# EasyEDA Pro project mcuboardpcb.epro

# Board PCB3
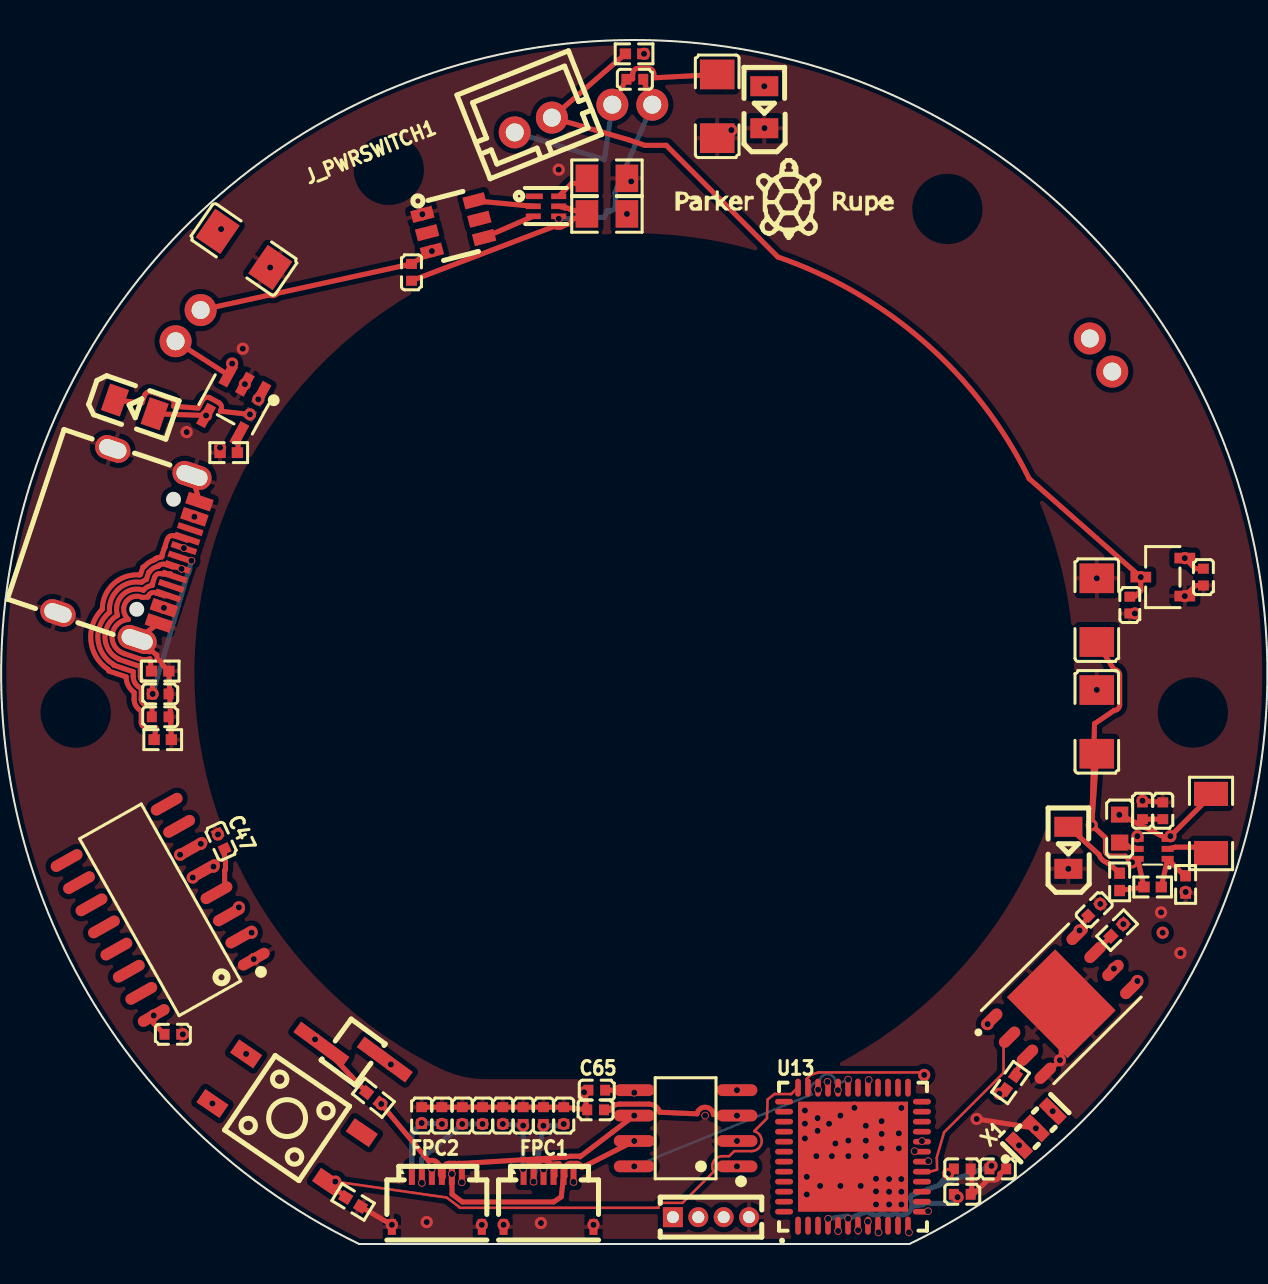
[diagram p0: board, top side]
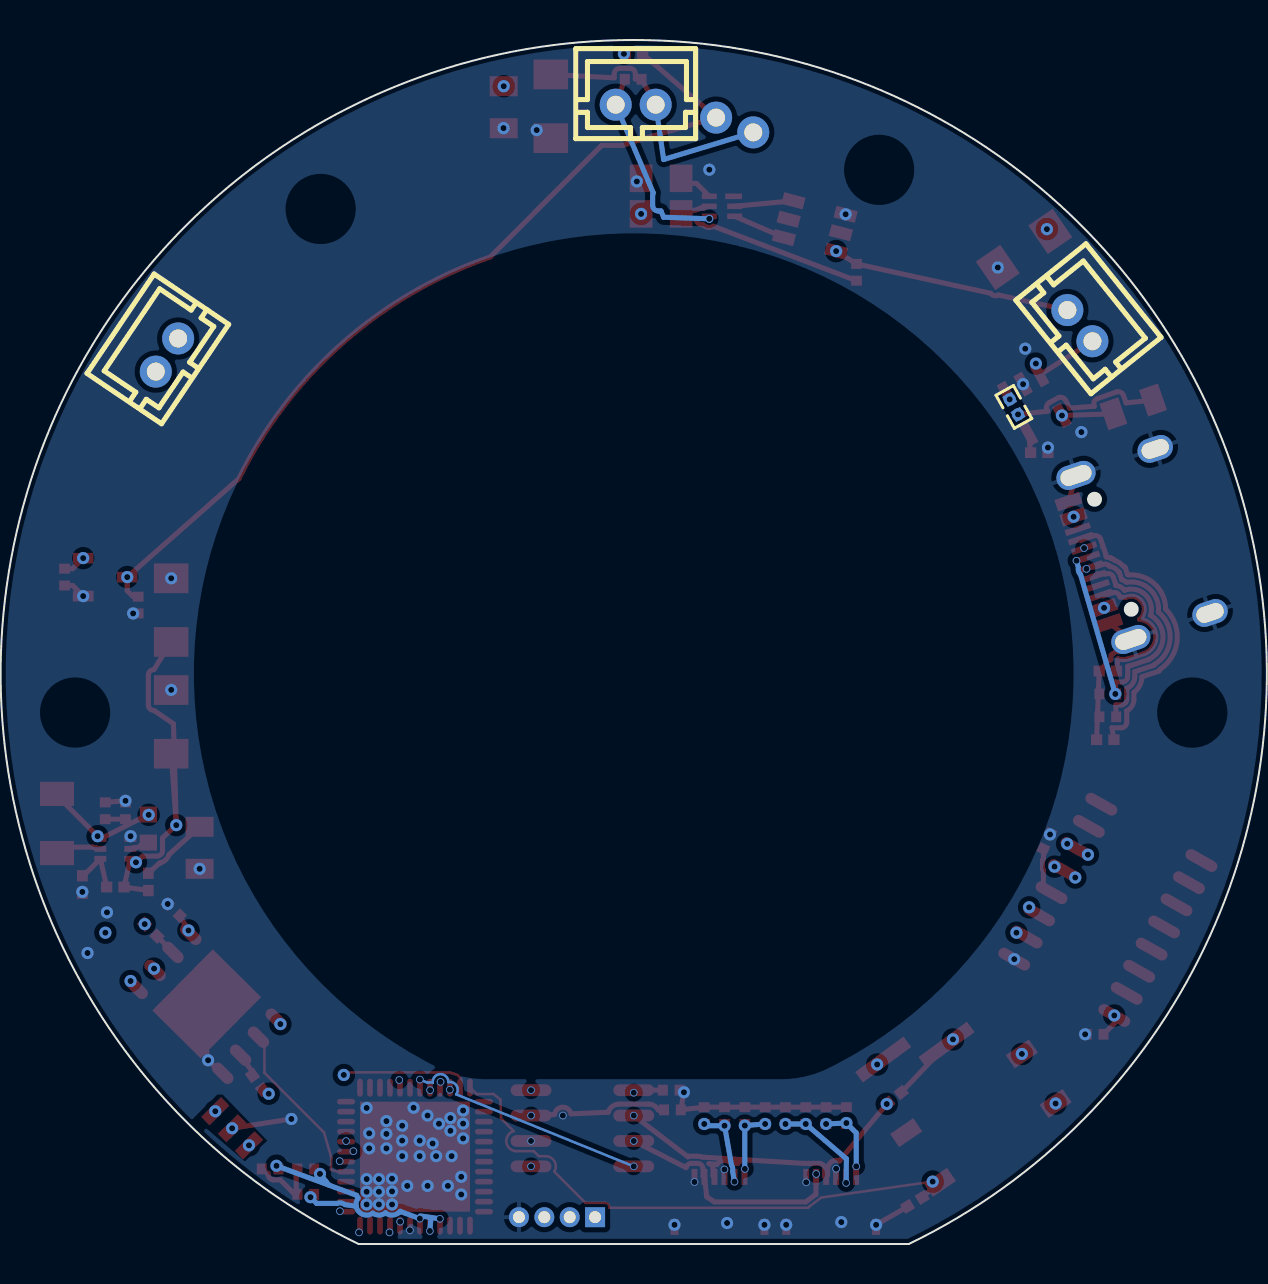
[diagram p1: board, bottom side, seen from below]

Outline 63.35 x 60.2 mm; copper layers: Top Layer, GND, 3V3, Inner3, Inner4, Bottom Layer. Coordinates in mm from the lower left corner of the outline.
Outline path: 17.91,0 45.44,0 arc(31.68,60.2) 17.91,0
Stack: Top Layer 0.035mm Outer layer thickness 1oz / Dielectric1 0.0994mm 3313 RC57% 4.2mil / GND 0.0152mm Inner layer thickness / Dielectric2 0.55mm 0.55mm H/H No copper / 3V3 0.0152mm Inner layer thickness / Dielectric3 0.1088mm 2116 RC54% 4.9mil / Inner3 0.0152mm Inner layer thickness / Dielectric4 0.55mm 0.55mm H/H No copper / Inner4 0.0152mm Inner layer thickness / Dielectric5 0.0994mm 3313 RC57% 4.2mil / Bottom Layer 0.035mm Outer layer thickness 1oz

## Design rules (mm)
template: Custom Config
spacing copperThickness1oz (default): track to track 0.102, other pairs 0.1 to 0.3
spacing copperThickness2oz: track to track 0.203, other pairs 0.152 to 0.3
track width copperThickness1oz (default): min 0.127, default 0.254, max 2.54
track width copperThickness2oz: min 0.203, default 0.254, max 2.54
differential pair differentialPair (default): width min 0.127, default 0.254, max 2.54; gap min 0.152, default 0.152
via viaSize (default): diameter min 0.1, default 0.61, max 10; hole min 0.05, default 0.305, max 6.3

## Placement (name value [footprint] x y rotation side)
C6  10nF  [C0402]  7.96 27.5 180 top
C7  10uF  [C0402]  58.12 21.66 270 top
C38  4.7uF  [C1206]  35.83 56.89 90 top
C39  4.7uF  [C1206]  12.15 49.73 325.5 top
C40  100nF  [C0402]  20.53 48.59 270 top
C43  100nF  [C0402]  48.09 3.75 0 top
C44  100nF  [C0402]  48.09 2.49 0 top
C45  100nF  [C0402]  49.87 3.75 0 top
C47  100nF  [C0402]  11.01 20.14 294.8 top
C50  100nF  [C0402]  8.59 10.49 0 top
C51  10nF  [C0402]  7.96 26.36 180 top
C52  100nF  [C0402]  56.47 31.95 90 top
C53  100nF  [C0402]  60.15 33.35 90 top
C54  22uF  [C1206]  54.82 31.7 270 top
C55  22uF  [C1206]  54.82 26.11 270 top
C56  1uF  [C0402]  57.11 21.66 270 top
C57  100nF  [C0402]  25.1 6.42 90 top
C58  100nF  [C0402]  28.15 6.42 90 top
C59  100nF  [C0402]  24.09 6.42 90 top
C60  100nF  [C0402]  21.04 6.42 90 top
C61  10uF  [C0402]  22.05 6.42 270 top
C62  10uF  [C0402]  23.07 6.42 270 top
C63  10uF  [C0402]  27.13 6.42 270 top
C64  10uF  [C0402]  26.12 6.42 270 top
C65  100nF  [C0402]  29.8 7.69 0 top
C66  100nF  [C0402]  29.74 6.71 180 top
C67  100nF  [C0402]  54.69 16.71 224.1 top
C_VBAT1  10uF  [C0402]  31.71 58.24 180 top
FPC1  HC-FPC-05-09-6RLTAG  [FPC-SMD_6P-P0.50_HC-FPC-05-09-6RLTAG]  27.39 2.1 180 top
FPC2  HC-FPC-05-09-6RLTAG  [FPC-SMD_6P-P0.50_HC-FPC-05-09-6RLTAG]  21.8 2.1 180 top
H3  M50-3630242  [HDR-SMD_2P-P1.27_M50-3630242]  17.61 9.6 233.8 top
J_BAT1  B2B-PH-K-S(LF)(SN)  [CONN-TH_B2B-PH-K-S]  55.03 44.45 124 bottom
J_BAT2  B2B-PH-K-S(LF)(SN)  [CONN-TH_B2B-PH-K-S]  9.35 45.92 231.2 bottom
J_BAT3  B2B-PH-K-S(LF)(SN)  [CONN-TH_B2B-PH-K-S]  31.58 56.97 180 bottom
J_PWRSWITCH1  B2B-PH-K-S(LF)(SN)  [CONN-TH_B2B-PH-K-S]  26.63 55.95 21.6 top
J_SWD1  PZ127V-11-04-0720  [HDR-TH_4P-P1.27-V-M]  35.52 1.34 0 top
J_USB1  TYPE-C-31-M-12  [USB-C_SMD-TYPE-C-31-M-12_1]  6.56 34.87 251.5 top
L1  1uH  [L0603]  55.96 20.77 90 top
LED4  KT-0805G  [LED0805-R-RD]  38.18 56.84 90 top
LED5  KT-0805G  [LED0805-R-RD]  6.69 41.86 340.9 top
LED6  KT-0805G  [LED0805-R-RD]  53.4 19.81 90 top
Q_BMS1  FS8205A  [SOT-23-6_L2.9-W1.6-P0.95-LS2.8-BR]  22.62 50.91 194.5 top
R6  5.1kΩ  [R0402]  8.08 25.22 180 top
R8  1kΩ  [R0402]  31.67 59.51 180 top
R9  2kΩ  [R0402]  11.39 39.57 0 top
R10  330Ω  [R0805]  30.31 51.51 0 top
R11  2.2kΩ  [R0805]  30.31 53.28 0 top
R13  5.1kΩ  [R0402]  7.96 28.65 180 top
R14  10kΩ  [R0402]  17.61 2.1 148.8 top
R15  10kΩ  [R0402]  59.27 17.98 90 top
R16  100kΩ  [R1206]  60.54 21.03 270 top
R17  1kΩ  [R0402]  55.96 18.11 270 top
R19  120Ω  [R0402]  18.63 7.31 141.7 top
R20  10kΩ  [R0402]  50.5 8.07 54.5 top
R21  10kΩ  [R0402]  55.84 15.69 44.3 top
R_FB1  73.2kΩ  [R0402]  57.61 17.85 0 top
R_STAT1  470Ω  [R0402]  12.66 41.86 60.9 bottom
SW3  SH-4.5x4.5x4.0H-TP  [SW-SMD_4P-SH-4.5X4.5X4.0H-TP]  14.31 6.29 325.8 top
U2  MCP73831T-2ACI/OT  [SOT-23-5_L3.0-W1.7-P0.95-LS2.8-BL]  11.64 41.98 151.2 top
U4  XC6206P332MR  [SOT-23-3_L3.0-W1.7-P0.95-LS2.9-BR]  58.12 33.35 0 top
U6  BQ29700DSER  [WSON-6_L1.5-W1.5-P0.50-TL]  27.26 51.89 0 top
U8  TCAN1042HVDRQ1  [SOIC-8_L4.9-W3.9-P1.27-LS6.0-BL]  34.25 5.79 90 top
U9  TPS61023DRLR  [SOT-563_L1.6-W1.2-P0.50-LS1.6-BR]  57.61 19.76 0 top
U12  W25Q128JVPIM TR  [WSON-8_L6.0-W5.0-P1.27-BL-EP]  53.04 12.01 314.7 top
U13  STM32G0B1CEU6  [UFQFPN-48_L7.0-W7.0-P0.50-BL-EP]  42.62 4.37 0 top
U_USB1  CH340C  [SOP-16_L10.0-W3.9-P1.27-LS6.0-BL]  7.96 16.71 119.4 top
X1  8MHz  [OSC-SMD_3P-L3.2-W1.3-P1.20-L]  51.77 5.79 45.3 top

## Footprints (pads in the part's own frame, mm; a bottom-side part is the same pattern mirrored in y, then rotated)
C0402
  rect 0.5x0.54 smd: 1(-0.42,0) 2(0.42,0)
C1206
  rect 1.485x1.728 smd: 1(-1.593,0) 2(1.593,0)
CONN-TH_B2B-PH-K-S
  round 1.6 hole 0.9: 1(1,0) 2(-1,0)
FPC-SMD_6P-P0.50_HC-FPC-05-09-6RLTAG
  rect 0.3x0.8 smd: 1(1.25,-1.25) 2(0.75,-1.25) 3(0.25,-1.25) 4(-0.25,-1.25) 5(-0.75,-1.25) 6(-1.25,-1.25)
  rect 0.4x0.8 smd: 7(-2.25,1.25) 8(2.25,1.25)
HDR-SMD_2P-P1.27_M50-3630242
  rect 0.65x3 smd: 1(-0.635,1.5) 2(0.635,-1.5)
HDR-TH_4P-P1.27-V-M
  rect 1x1 hole 0.6: 1(-1.905,0)
  round 1 hole 0.6: 2(-0.635,0) 3(0.635,0) 4(1.905,0)
L0603
  rect 0.8x0.864 smd: 1(-0.7,0) 2(0.7,0)
LED0805-R-RD
  rect 1x1.399 smd: 1(1.05,0) 2(-1.05,0)
OSC-SMD_3P-L3.2-W1.3-P1.20-L
  rect 0.6x1.4 smd: 1(-1.199,0) 2(0,0) 3(1.199,0)
R0402
  rect 0.566x0.54 smd: 1(-0.433,0) 2(0.433,0)
R0805
  rect 1.133x1.377 smd: 1(-1,0) 2(1,0)
R1206
  rect 1.208x1.701 smd: 1(-1.479,0) 2(1.479,0)
SOIC-8_L4.9-W3.9-P1.27-LS6.0-BL
  oval 0.588x2.045 smd: 1(-1.905,-2.57) 2(-0.635,-2.57) 3(0.635,-2.57) 4(1.905,-2.57) 5(1.905,2.57) 6(0.635,2.57) 7(-0.635,2.57) 8(-1.905,2.57)
SOP-16_L10.0-W3.9-P1.27-LS6.0-BL
  oval 0.56x1.745 smd: 1(-4.445,-2.873) 2(-3.175,-2.873) 3(-1.905,-2.873) 4(-0.635,-2.873) 5(0.635,-2.873) 6(1.905,-2.873) 7(3.175,-2.873) 8(4.445,-2.873) 9(4.445,2.873) 10(3.175,2.873) 11(1.905,2.873) 12(0.635,2.873) 13(-0.635,2.873) 14(-1.905,2.873) 15(-3.175,2.873) 16(-4.445,2.873)
SOT-23-3_L3.0-W1.7-P0.95-LS2.9-BR
  rect 1.038x0.532 smd: 1(1.101,-0.95) 2(1.101,0.95) 3(-1.101,0)
SOT-23-5_L3.0-W1.7-P0.95-LS2.8-BL
  rect 0.49x1.157 smd: 1(-0.95,-1.154) 2(0,-1.153) 3(0.95,-1.153)
  rect 0.49x1.175 smd: 4(0.95,1.154) 5(-0.95,1.153)
SOT-23-6_L2.9-W1.6-P0.95-LS2.8-BR
  rect 1.1x0.6 smd: 1(1.35,-0.95) 2(1.35,0) 3(1.35,0.95) 4(-1.35,0.95) 5(-1.35,0) 6(-1.35,-0.95)
SOT-563_L1.6-W1.2-P0.50-LS1.6-BR
  rect 0.6x0.3 smd: 1(0.75,-0.5) 2(0.75,0) 3(0.75,0.5) 4(-0.75,0.5) 5(-0.75,0) 6(-0.75,-0.5)
SW-SMD_4P-SH-4.5X4.5X4.0H-TP
  rect 1.4x0.8 smd: 1(-3.5,1.5) 2(3.5,1.5) 3(-3.5,-1.5) 4(3.5,-1.5)
UFQFPN-48_L7.0-W7.0-P0.50-BL-EP
  oval 0.28x0.9 smd: 1(-2.751,-3.45) 2(-2.251,-3.45) 3(-1.75,-3.45) 4(-1.25,-3.45) 5(-0.749,-3.45) 6(-0.249,-3.45) 7(0.249,-3.45) 8(0.75,-3.45) 9(1.25,-3.45) 10(1.75,-3.45) 11(2.251,-3.45) 12(2.751,-3.45) 25(2.751,3.449) 26(2.251,3.449) 27(1.75,3.449) 28(1.25,3.449) 29(0.75,3.449) 30(0.249,3.449) 31(-0.249,3.449) 32(-0.749,3.449) 33(-1.25,3.449) 34(-1.75,3.449) 35(-2.251,3.449) 36(-2.751,3.449)
  oval 0.9x0.28 smd: 13(3.45,-2.751) 14(3.45,-2.251) 15(3.45,-1.75) 16(3.45,-1.25) 17(3.45,-0.75) 18(3.45,-0.249) 19(3.45,0.249) 20(3.45,0.749) 21(3.45,1.25) 22(3.45,1.75) 23(3.45,2.251) 24(3.45,2.751) 37(-3.449,2.751) 38(-3.449,2.251) 39(-3.449,1.75) 40(-3.449,1.25) 41(-3.449,0.749) 42(-3.449,0.249) 43(-3.449,-0.249) 44(-3.449,-0.75) 45(-3.449,-1.25) 46(-3.449,-1.75) 47(-3.449,-2.251) 48(-3.449,-2.751)
  rect 5.5x5.5 smd: 49(0,0)
USB-C_SMD-TYPE-C-31-M-12_1
  oval 1.2x2 hole 0.8x1.6: 1(4.325,1.706) 4(-4.325,1.706)
  oval 1.2x1.8 hole 0.8x1.4: 2(4.325,-2.474) 3(-4.325,-2.474)
  custom 0.6x1.3 smd: A1B12(-3.2,2.474) A4B9(-2.4,2.474) B1A12(3.2,2.474) B4A9(2.401,2.474)
  rect 0.3x1.3 smd: A5(-1.25,2.474) A6(-0.25,2.474) A7(0.25,2.474) A8(1.25,2.474) B5(1.75,2.474) B6(0.75,2.474) B7(-0.75,2.474) B8(-1.75,2.474)
WSON-6_L1.5-W1.5-P0.50-TL
  rect 0.84x0.28 smd: 1(-0.581,0.5)
  rect 0.75x0.28 smd: 2(-0.636,0) 3(-0.636,-0.5) 4(0.636,-0.5) 5(0.636,0) 6(0.636,0.5)
WSON-8_L6.0-W5.0-P1.27-BL-EP
  oval 0.581x1.276 smd: 1(-1.905,-3.013) 2(-0.635,-3.012) 3(0.635,-3.013) 4(1.905,-3.013) 5(1.905,3.013) 6(0.635,3.012) 7(-0.635,3.013) 8(-1.905,3.013)
  rect 4.3x3.4 smd: 9(0,0)

## Nets
3V3: C43.1 C44.1 C45.1 C50.1 C53.2 C57.1 C60.1 C61.2 C64.2 C65.2 C67.2 FPC1.1 FPC2.1 J_SWD1.1 R20.1 R21.2 SW3.1 U4.2 U8.5 U12.8 U13.4 U13.5 U13.6 U_USB1.16
+5V: C54.2 C55.2 C66.1 R17.2 R_FB1.1 U8.3 U9.6
GND: C6.1 C7.1 C38.1 C39.2 C43.2 C44.2 C45.2 C47.1 C50.2 C51.1 C52.1 C53.1 C54.1 C55.1 C56.1 C57.2 C58.2 C59.2 C60.2 C61.1 C62.1 C63.1 C64.1 C65.1 C66.2 C67.1 FPC1.3 FPC1.6 FPC1.7 FPC1.8 FPC2.3 FPC2.6 FPC2.7 FPC2.8 J_SWD1.4 J_USB1.1 J_USB1.2 J_USB1.3 J_USB1.4 J_USB1.A1B12 J_USB1.B1A12 LED4.2 LED6.2 Q_BMS1.1 R6.1 R9.1 R11.2 R13.1 R14.1 R15.1 U2.2 U4.1 U8.2 U9.4 U12.4 U12.9 U13.7 U13.49 U_USB1.1 X1.2
VBAT: C7.2 C52.2 C56.2 C58.1 C59.1 C62.2 C63.2 FPC1.2 FPC2.2 J_PWRSWITCH1.1 L1.2 R8.2 R16.1 U4.3 U9.3
VBUS_5V: C39.1 J_USB1.A4B9 J_USB1.B4A9 LED5.1 U2.4
BOOT0: R14.2 SW3.4 U13.36
CANFD_RX: U8.4 U13.20
CANFD_TX: U8.1 U13.19
CANH: FPC1.5 FPC2.5 H3.1 U8.7
CANL: FPC1.4 FPC2.4 R19.1 U8.6
CH340C_RX: U13.29 U_USB1.3
CH340C_TX: U13.32 U_USB1.2
FLASH_CS: U12.1 U13.13
OSC_IN: U13.8 X1.1
OSC_OUT: U13.9 X1.3
SPI1_MISO: U12.2 U13.17
SPI1_MOSI: U12.5 U13.18
SPI1_SCK: U12.6 U13.12
STB: U8.8 U13.31
SWD_CLK: J_SWD1.3 SW3.3
SWD_IO: J_SWD1.2 U13.35
U_USB_D+: C6.2 J_USB1.A6 J_USB1.B6 U13.34 U_USB1.5
U_USB_D-: C51.2 J_USB1.A7 J_USB1.B7 U13.33 U_USB1.6
$1N887: C40.1 C_VBAT1.1 J_BAT1.2 J_BAT2.2 J_BAT3.2 Q_BMS1.3 U6.4
$1N890: Q_BMS1.6 U6.2
$1N891: C40.2 R10.1 U6.5
$1N894: LED5.2 R_STAT1.1
$1N895: R_STAT1.2 U2.1
$1N897: R9.2 U2.5
$1N898: Q_BMS1.4 U6.3
$1N900: C38.2 C_VBAT1.2 J_BAT1.1 J_BAT2.1 J_BAT3.1 J_PWRSWITCH1.2 R10.2 U2.3
$1N3156: J_USB1.B5 R13.2
$1N8915: R15.2 R_FB1.2 U9.1
$1N8918: R16.2 U9.2
$1N8921: L1.1 U9.5
$1N8925: LED6.1 R17.1
$1N19964: LED4.1 R8.1
$1N22151: R11.1 U6.6
$1N22590: C47.2 U_USB1.4
$1N22735: J_USB1.A5 R6.2
$1N28064: H3.2 R19.2
$1N32733: R20.2 U12.3
$1N32803: R21.1 U12.7

Pads without a net: J_USB1 A8 B8; Q_BMS1 2 5; SW3 2; U6 1; U13 1 2 3 10 11 14 15 16 21 22 23 24 25 26 27 28 30 37 38 39 40 41 42 43 44 45 46 47 48; U_USB1 7 8 9 10 11 12 13 14 15

## Via types
v1: diameter 0.61, hole 0.305, Top Layer to Bottom Layer, 122 vias
v2: diameter 0.381, hole 0.305, Top Layer to Bottom Layer, 37 vias
v3: diameter 0.406, hole 0.305, Top Layer to Bottom Layer, 1 via

## Routing (per net, layer and track width the routed paths; a pad name or vN(x,y) marks a point on that pad's centre or on a via; arc(x,y) is an arc through that point)
3V3: length 24.9
  Top Layer w0.254: C50.1 7.63,11.03 v1(7.63,11.43) ; C53.2 59.75,33.77 v1(59.22,34.3) ; 30.09,7.69 U8.5 ; C67.2 U12.8
  Bottom Layer w0.254: 45.57,1.89 46.12,1.97 arc(46.32,2.05) 46.53,2.03 47.54,2.03 v1(47.85,2.34) ; 45.57,1.89 arc(45.24,1.49) 44.73,1.54 arc(44.41,1.45) 44.1,1.56 arc(43.76,1.45) 43.43,1.57 arc(43.4,1.6) 43.37,1.63 v2(42.38,1.27) ; 45.57,1.89 arc(45.56,2.1) 45.47,2.29 arc(45.51,2.36) 45.54,2.43 46.92,2.94 ; 46.92,2.94 v1(49.55,3.91) ; 46.92,2.94 v1(47.38,3.5) ; v2(26.12,3.75) v1(26.12,5.92) v1(25.1,6) ; v2(41.38,1.26) 41.82,1.33 ; 41.82,1.33 v2(41.88,0.65) ; 41.82,1.33 42.36,1.41 ; v1(22.05,6) v1(21.04,6.05) 20.55,5.56 v2(20.55,3.88)
  vias: v1(12.26,9.5) v1(49.94,7.51) v1(53.96,15.68) v1(56.15,16) v1(58.11,15.57) v2(31.68,7.56)
+5V: length 51.9
  Top Layer w0.254: 30.16,6.71 30.45,6.7 arc(30.66,6.91) 30.95,7 32.41,7 arc(32.75,6.88) 32.95,6.59 34.82,6.51 arc(35.24,6.84) 35.64,6.47 v2(36.82,6.42) ; C55.2 v1(54.57,20.94) ; v1(54.57,20.94) 54.71,26.02 55.68,26.68 arc(55.88,26.76) 55.96,26.96 55.96,28.44 arc(55.88,28.64) 55.68,28.72 C54.2 ; v1(54.57,20.94) 55.25,20.31 55.25,19.67 arc(55.33,19.48) 55.53,19.39 56.25,19.39 v1(56.58,19.09) ; R17.2 R_FB1.1 U9.6
  Inner4 w0.127: v1(54.57,20.94) 50.95,17.98 arc(48.26,14.12) 44.81,10.92 43.81,8.17 arc(43.8,8.15) 43.8,8.13 arc(43.79,8.13) 43.79,8.12 arc(43.67,7.91) 43.45,7.81 arc(43.36,7.81) 43.26,7.82 ; 43.24,7.85 42.46,7.52 arc(42.36,7.49) 42.26,7.44 42.06,7.35 arc(42.02,7.33) 41.98,7.32 40.73,7.35 arc(40.73,7.35) 40.72,7.36 40.71,7.37 39.58,7.79 39.55,7.83 39.38,7.83 39.36,7.83 39.36,7.83 38.53,7.83 v2(36.82,6.42)
GND: length 33.4
  Top Layer w0.254: J_USB1.A1B12 J_USB1.4 ; J_USB1.B1A12 J_USB1.1 7.42,29.62 7.55,29.63 7.78,29.45 7.81,29.22 7.84,29.19 arc(8,29.11) 8.08,28.95 R13.1 R6.1 ; C45.2 49.98,3.52 49.98,3.49 arc(49.89,3.29) 49.7,3.21 49.36,3.21 48.56,2.41 48.56,3.7 C43.2 ; C60.2 C61.1 C62.1 C59.2 C57.2 C64.1 C63.1 C58.2 C66.2 v1(29.17,7.59) ; v1(48.81,6.25) v1(51.77,5.79) ; 17.97,1.87 v1(19.55,0.96) ; v1(57.11,22.16) C7.1 ; C53.1 59.75,32.93 v1(59.22,32.4) ; 53.04,12.77 53.04,9.26 v1(52.97,9.19) 52.42,8.63 52.38,8.63 52,8.25
  vias: v1(9.09,10.49) v1(9.28,40.6) v1(10.85,20.48) v1(10.95,39.82) v1(12.09,44.77) v1(12.2,42.99) v1(12.64,14.24) v1(13.46,48.83) v1(21.07,51.49) v1(21.29,1.09) v1(24.05,0.96) v1(25.14,0.96) v1(27.01,1.05) v1(27.9,53.72) v1(29.64,0.96) v1(31.52,53.13) v1(36.53,55.7) v1(38.19,55.8) v1(40.22,6.68) v1(40.22,6.02) v1(40.22,5.28) v1(40.31,3.36) v1(40.31,2.48) v1(40.79,4.39) v1(40.85,6.29) v1(40.85,5.66) v1(40.98,2.91) v1(41.42,6.01) v1(41.57,4.39) v1(41.74,5.03) v1(41.99,6.42) v1(41.99,2.91) v1(42.39,5.17) v1(42.39,4.39) v1(42.69,6.81) v1(43.01,2.91) v1(43.26,5.91) v1(43.26,5.17) v1(43.26,4.39) v1(43.77,3.26) v1(43.77,2.63) v1(43.77,1.98) v1(44.05,6.14) v1(44.05,5.51) v1(44.05,4.78) v1(44.43,3.25) v1(44.43,2.61) v1(44.43,1.98) v1(44.91,5.53) v1(44.91,4.78) v1(45.04,6.8) v1(45.04,3.25) v1(45.04,2.61) v1(45.04,1.98) v1(53.4,18.76) v1(54.82,33.29) v1(54.82,27.71) v1(55,17) v1(56.73,31.53) v1(56.85,20.39) v1(58.03,16.58) v1(59.01,14.55) v1(59.27,17.61) v2(21.55,3.77) v2(23.05,3.09) v2(27.14,3.73) v2(28.64,3.1) v2(35.22,6.42) v2(36.82,5.15) v2(42.88,0.69)
VBAT: length 116.5
  Top Layer w0.254: R16.1 60.54,22.42 v1(58.5,20.39) ; L1.2 U9.3 ; 56.73,32.37 57.02,32.67 v1(57.02,33.35) 51.44,38.27 arc(46.24,45.05) 38.86,49.35 33.28,54.94 32.21,54.94 31.41,55.21 J_PWRSWITCH1.1 R8.2 ; C7.2 C56.2
  Inner3 w0.254: v1(57.02,33.35) 57.2,31.77 arc(57.25,31.59) 57.24,31.41 v1(58.5,20.39)
  Inner4 w0.127: v1(55.95,21.46) 55.03,20.88 arc(54.82,20.55) 54.42,20.5 51.13,17.83 arc(48.45,13.99) 45.03,10.8 44.02,8.09 arc(43.92,7.85) 43.73,7.67 arc(43.61,7.61) 43.48,7.58 arc(43.47,7.58) 43.47,7.58 42.17,7.15 arc(42.13,7.13) 42.1,7.12 42.07,7.09 41.49,7.09 40.94,7.1 arc(40.86,7.09) 40.79,7.1 arc(40.66,7.13) 40.54,7.19 39.45,7.6 38.62,7.6 37.21,6.45 arc(37.06,6.12) 36.72,6.04 35.43,6.04 30.93,5.8 27.53,3.67 arc(27.35,3.4) 27.02,3.35 v2(26.64,3.12) 23.44,3.08 arc(23.05,2.69) 22.66,3.07 v2(21.05,3.06)
  Bottom Layer w0.254: v2(21.05,3.06) 21.04,4.26 v1(23.07,6) v1(24.09,6) ; 28.02,5.91 v1(27.13,5.91) 26.79,3.95 arc(26.73,3.8) 26.73,3.64 v2(26.64,3.12)
  vias: v1(28.15,6)
VBUS_5V: length 24.5
  Top Layer w0.254: v1(10.25,41.43) LED5.1
  Inner3 w0.254: v1(9.67,36.36) 9.79,37.44 arc(10.78,38.1) 10.21,39.14 10,39.21 v1(10.25,41.43) 10.61,45.82 arc(11.06,46.61) 10.74,47.47 v1(11.01,50.75)
  Inner4 w0.254: v1(9.67,36.36) 9.29,35.23 arc(9.56,34.98) 9.56,34.62 arc(9.95,34.31) 9.83,33.83 arc(9.84,33.77) 9.83,33.71 arc(9.38,33.03) 8.57,33.09 v1(8.15,31.81)
BOOT0: length 28.8
  Top Layer w0.127: 38.72,7.5 39.49,7.5 arc(39.51,7.5) 39.53,7.5 39.88,7.84 ; 38.32,6.34 38.35,7.22 38.71,7.51 ; v1(16.72,3.12) 22.29,2.32 22.88,1.88 22.95,1.81 32.9,1.81 32.9,1.84 arc(32.96,1.99) 33.11,2.06 34.09,2.06 35.65,3.62 arc(35.64,4.13) 36.09,4.39 36.43,4.39 36.68,4.64 37.55,4.64 arc(38.05,5.08) 37.68,5.64 38.33,6.29
  Top Layer w0.254: 17.25,2.34 SW3.4
CANFD_RX: length 10.6
  Inner3 w0.127: v2(46.07,5.15) 45.49,5.73 45.38,5.73 45.11,6 45.09,6 43.4,7.69 42.42,7.69 42.03,7.3 40.74,7.3 40.35,7.69 v2(36.82,7.69)
CANFD_TX: length 9.2
  Inner3 w0.127: v2(36.82,3.88) 44.95,3.88 v2(45.71,4.64)
CANH: length 18.5
  Top Layer w0.254: v2(31.68,5.15) 29.06,3.82 arc(28.96,3.97) 28.79,4.03 28.49,4.03 arc(28.29,3.95) 28.21,3.75 28.21,3.39 FPC1.5 28.02,2.36 27.64,2.1 23.07,2.1 22.56,2.49 FPC2.5
  Inner3 w0.254: v1(19.5,8.98) 20.25,7.63 20.51,6.09 arc(20.51,5.96) 20.55,5.84 arc(20.67,5.66) 20.85,5.55 22.02,4.45 v2(22.55,3.5)
CANL: length 18.7
  Top Layer w0.254: v1(19.02,7) 21.39,4.15 arc(21.74,4.14) 21.96,3.87 arc(21.97,3.81) 21.98,3.75 21.98,3.44 FPC2.4 22.12,3.36 22.12,3.75 arc(22.2,3.95) 22.4,4.03 22.7,4.03 arc(22.75,4.03) 22.8,4.01 arc(22.85,4.03) 22.9,4.03 23.2,4.03 26.08,4.21 ; 26.11,4.21 26.08,4.21 ; 26.11,4.21 28.26,4.35 arc(28.37,4.38) 28.49,4.39 28.94,4.39 28.96,4.37 arc(28.96,4.36) 28.97,4.36 30.56,5.57 arc(30.6,5.61) 30.65,5.64 v2(31.68,6.42) ; 26.11,4.21 arc(26.09,4.21) 26.08,4.21 ; 26.11,4.21 arc(26.31,4.17) 26.48,4.03 arc(26.48,4.03) 26.49,4.03 26.79,4.03 arc(26.79,4.03) 26.8,4.03 arc(27.17,4.18) 27.52,3.98 27.91,4.02 arc(27.77,3.92) 27.71,3.75 27.71,3.41 FPC1.4
CH340C_RX: length 35
  Inner4 w0.127: v1(11.89,16.84) 13.33,16.46 arc(17.14,12.06) 21.98,8.82 arc(23.1,8.42) 24.28,8.28 39.17,8.28 ; v2(43.41,8.2) 41.74,8.96 41.69,8.98 arc(41.53,8.9) 41.38,8.82 arc(40.3,8.43) 39.17,8.29
CH340C_TX: length 32.6
  Inner4 w0.127: v2(41.87,7.69) 41.87,8.11 41.65,8.42 41.27,8.52 arc(40.29,8.19) 39.26,8.06 39.26,8.06 24.28,8.06 arc(23.05,8.2) 21.87,8.62 arc(17.49,11.46) 13.9,15.25 v1(12.53,15.57)
FLASH_CS: length 10.9
  Inner4 w0.127: v1(49.36,11) 46.65,8.29 46.65,4.91 46.04,4.29 46.04,4 46.38,3.65 v2(46.38,1.64)
OSC_IN: length 9.2
  Inner3 w0.127: v1(50.93,4.94) 49.81,4.37 arc(49.31,4.38) 49.02,3.97 47.9,3.41 arc(47.62,3.03) 47.15,3.03 45.52,2.21 arc(45.39,1.57) 44.73,1.54 arc(44.45,1.45) 44.16,1.52 v2(43.36,1.12)
OSC_OUT: length 11.5
  Inner3 w0.127: v1(52.62,6.64) 52.28,5.15 48.32,2.43 arc(48.12,1.96) 47.61,1.94 46.18,0.96 45.63,0.87 arc(45.36,0.93) 45.13,0.79 v2(43.9,0.58)
SPI1_MISO: length 8.1
  Top Layer w0.127: 46.8,4.31 47.18,5.59 50.15,8.56 50.15,10 ; 46.33,3.58 46.83,3.71 46.82,4.3
SPI1_MOSI: length 14.5
  Inner3 w0.254: v1(56.85,13.15) 53.42,9.72 52.63,9.72 52.32,9.41 52.32,8.87 47.59,4.14 v2(46.39,4.14)
SPI1_SCK: length 18
  Inner4 w0.127: v2(45.42,0.58) 46.01,1.38 arc(46.64,1.27) 46.75,1.9 51.45,6.6 51.45,9.54 v1(55.68,13.77)
STB: length 12.5
  Bottom Layer w0.127: v2(31.68,3.88) 40.56,7.48 arc(40.55,7.93) 40.95,8.1 arc(41.33,8.5) 41.74,8.12 arc(41.74,8.09) 41.73,8.06 arc(41.86,8.08) 41.99,8.06 v2(42.38,8.22)
SWD_CLK: length 28.7
  Inner4 w0.254: v1(10.57,7.02) 11.41,7.02 18.01,0.43 35.24,0.43 J_SWD1.3
SWD_IO: length 19.7
  Top Layer w0.127: 40.3,7.96 40.3,8.25 40.51,8.46 40.9,8.58 46.06,8.58 v1(46.18,8.45)
  Inner4 w0.127: 34.88,1.34 35.46,1.71 arc(35.74,2) 36.12,2.12 v1(46.18,8.45)
U_USB_D+: length 62.5
  Top Layer w0.254: 8.03,33.51 8.12,33.51 8.48,33.51 8.61,33.37 J_USB1.B6 ; C6.2 7.59,28.1 7.24,28.1 arc(7.04,28.18) 6.96,28.38 6.96,28.89 arc(6.88,28.9) 6.79,28.93 5.9,29.23 5.89,29.24 arc(5.19,30.32) 5.82,31.43 arc(6.08,32.46) 7.12,32.69 7.12,32.69 arc(7.31,32.85) 7.55,32.93 arc(7.56,32.94) 7.57,32.95 arc(7.57,33) 7.58,33.05 7.68,33.34 arc(7.82,33.5) 8.03,33.51
  Inner3 w0.127: v1(7.58,27.5) 9.56,26.47 arc(9.72,25.21) 9.95,23.97 9.56,20.2 arc(9.52,20.06) 9.53,19.92 arc(9.6,19.75) 9.72,19.63 v1(10.62,18.87) 10.96,18.87 12.25,17.8 arc(16.36,12.47) 21.87,8.62 arc(23.05,8.2) 24.28,8.06 39.26,8.06 39.26,8.06 arc(40.02,8.14) 40.77,8.32 40.85,8.2 v2(40.88,7.71)
  Bottom Layer w0.254: v1(7.58,27.5) 9.32,33.46 arc(9.43,33.64) 9.43,33.85 v2(9.52,34.17)
  vias: v1(9.59,18.32)
U_USB_D-: length 65.1
  Top Layer w0.254: C51.2 7.56,26.95 7.29,26.95 arc(7.09,27.04) 7.01,27.23 7.01,27.77 arc(7.01,27.78) 7.01,27.79 arc(6.72,28.02) 6.61,28.38 6.61,28.62 5.64,28.94 5.62,28.98 arc(4.84,30.24) 5.43,31.59 arc(5.85,32.73) 7.02,33.08 arc(7.14,33.16) 7.26,33.22 7.39,33.59 7.42,33.6 arc(7.59,33.78) 7.82,33.87 7.82,33.89 7.85,33.89 7.92,33.94 7.93,33.94 arc(8.05,34) 8.19,33.99 8.57,33.86 8.83,33.85
  Inner3 w0.127: 39.17,8.28 24.28,8.28 arc(23.1,8.42) 21.98,8.82 arc(16.33,12.81) 12.2,18.37 v1(9.99,20.01) 10.23,23.77 arc(9.68,28.75) 10.24,33.73 9.99,34.36 9.56,34.8 v2(9.15,34.8) ; v2(41.35,8.11) 41.36,8.58 41.2,8.74 arc(40.21,8.41) 39.17,8.29
  Inner4 w0.254: v2(9.03,33.76) 9.07,34.15 arc(9.07,34.22) 9.09,34.28 v2(9.15,34.8)
  vias: v1(8.95,19.47)
$1N887: length 56.7
  Top Layer w0.254: C_VBAT1.1 J_BAT3.2 ; v1(21.55,49.65) C40.1 13.81,47.54 arc(13.64,47.42) 13.44,47.45 J_BAT2.2
  Inner3 w0.254: v3(27.9,51.26) 21.55,49.73 ; J_BAT1.2 55.87,44.27 55.83,45.16 55.47,45.68 arc(55.36,45.89) 55.21,46.07 arc(54.82,46.3) 54.36,46.35 arc(54.01,46.25) 53.71,46.05 J_BAT3.2
  Bottom Layer w0.254: J_BAT3.2 30.7,52.56 arc(30.72,52.5) 30.73,52.43 30.73,51.93 arc(30.65,51.73) 30.45,51.65 30.32,51.65 30.18,51.34 v3(27.9,51.26)
$1N890: length 2.9
  Top Layer w0.254: U6.2 Q_BMS1.6
$1N891: length 11
  Top Layer w0.254: C40.2 27.68,50.89 arc(27.96,50.84) 28.21,50.97 28.27,50.97 arc(28.46,51.04) 28.55,51.22 R10.1 28.46,51.74 arc(28.37,51.79) 28.27,51.81 28.2,51.81 U6.5
$1N894: length 8.3
  Top Layer w0.254: v1(12.45,41.48) 10.97,41.64 10.99,41.69 arc(11.02,41.9) 10.88,42.07 10.45,42.31 arc(10.24,42.33) 10.08,42.19 9.86,41.8 8.63,41.89 8.65,41.92 arc(8.63,42.13) 8.47,42.27 7.53,42.6 arc(7.31,42.59) 7.17,42.43 7.04,42.06 LED5.2
$1N895:
  vias: v1(12.87,42.23)
$1N897: length 0.9
  Top Layer w0.254: 11.82,39.57 U2.5
$1N898: length 2.7
  Top Layer w0.254: U6.3 Q_BMS1.4
$1N900: length 68.3
  Top Layer w0.254: J_BAT3.1 C_VBAT1.2 31.6,58.25 31.6,58.51 arc(31.68,58.71) 31.88,58.79 32.38,58.79 arc(32.57,58.71) 32.66,58.51 32.66,58.31 C38.2 ; U2.3 J_BAT2.1
  Inner3 w0.254: 54.47,45.28 32.76,55.9 arc(32.11,56) 31.63,56.45 J_BAT3.1 ; v1(11.56,44.02) 11.87,44.28 arc(12.43,44.36) 12.61,44.88 20.55,51.38 arc(20.74,51.9) 21.29,51.98 J_PWRSWITCH1.2
  Inner4 w0.254: J_BAT3.1 31.06,53.39 arc(30.99,53.06) 31.14,52.76 v1(31.31,51.51)
  Bottom Layer w0.254: J_PWRSWITCH1.2 30.18,54.23 J_BAT3.1
$1N3156: length 7.7
  Top Layer w0.254: R13.2 7.45,29.26 arc(7.18,29.22) 6.91,29.27 6.15,29.52 arc(5.56,30.47) 6.37,31.23 arc(6.23,32.09) 7.06,32.33 7.35,32.35 7.36,32.39 arc(7.5,32.55) 7.71,32.56 8.17,32.41 J_USB1.B5
$1N8915: length 2.6
  Top Layer w0.254: 59.14,18.41 59.14,18.48 U9.1 R_FB1.2
$1N8918: length 2.3
  Top Layer w0.254: U9.2 58.69,19.83 arc(58.73,19.83) 58.76,19.84 60.24,19.84 R16.2
$1N8921: length 1
  Top Layer w0.254: U9.5 56.66,19.83 56.56,19.83 arc(56.44,19.86) 56.34,19.94 L1.1
$1N8925: length 3.5
  Top Layer w0.254: LED6.1 54.93,19.48 arc(55.09,19.21) 55.36,19.06 55.38,19.04 55.41,19.04 R17.1
$1N19964: length 6.2
  Inner3 w0.254: v1(32.17,59.51) v1(38.18,57.89)
$1N22151: length 1.6
  Top Layer w0.254: U6.6 28.54,53.03 29.18,53.03
$1N22590: length 2.4
  Top Layer w0.254: U_USB1.4 11.18,17.97 11.18,18.69 11.23,18.73 11.23,19.19 11.18,19.24 11.18,19.76
$1N22735: length 15
  Top Layer w0.254: 7.65,25.22 7.75,25.81 7.29,25.81 arc(7.09,25.89) 7.01,26.09 7.01,26.63 arc(7.01,26.65) 7.01,26.66 arc(6.75,26.9) 6.65,27.23 6.65,27.58 arc(6.36,27.92) 6.25,28.36 5.39,28.65 5.35,28.73 arc(4.49,30.17) 5.06,31.74 arc(5.62,33.01) 6.93,33.45 arc(6.95,33.47) 6.97,33.48 7.1,33.84 7.18,33.89 arc(7.38,34.07) 7.62,34.19 7.69,34.25 7.73,34.25 7.8,34.31 7.85,34.31 arc(7.94,34.34) 8.03,34.35 arc(8.04,34.36) 8.04,34.37 arc(8.05,34.42) 8.06,34.47 8.15,34.76 arc(8.17,34.81) 8.2,34.85 arc(8.2,34.9) 8.22,34.95 8.31,35.23 arc(8.45,35.39) 8.66,35.41 9.29,35.2 9.3,35.27
$1N28064: length 3.3
  Top Layer w0.254: H3.2 R19.2
  vias: v1(15.7,10.23)
$1N32733: length 1.2
  Top Layer w0.254: 50.63,8.43 U12.3
$1N32803: length 1.1
  Top Layer w0.254: U12.7 R21.1

## Copper pours and planes (outline as drawn; the poured copper is in the pictures)
3V3 on 3V3: 0.26,59.95 63.1,59.95 63.1,0.26 0.26,0.26
GND on Top Layer: 45.44,0 31.68,60.2 17.91,0
GND on Bottom Layer: 45.44,0 31.68,60.2 17.91,0
GND on GND: 0.26,59.95 63.1,59.95 63.1,0.26 0.26,0.26

Small or netless copper shapes (teardrops, artwork), in the pictures only: 19 on GND, 3 on 3V3
